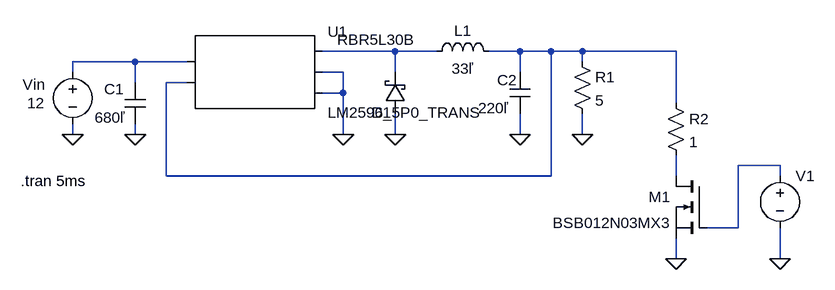
[diagram p0: schematic Voltage_Mode_Control.asc]
Voltage_Mode_Control.asc, the LTspice schematic file:
Version 4
SHEET 1 1144 680
WIRE 496 240 384 240
WIRE 560 240 496 240
WIRE 688 240 640 240
WIRE 736 240 688 240
WIRE 784 240 736 240
WIRE 928 240 784 240
WIRE 96 256 0 256
WIRE 176 256 96 256
WIRE 784 256 784 240
WIRE 0 272 0 256
WIRE 416 272 384 272
WIRE 496 272 496 240
WIRE 688 272 688 240
WIRE 96 288 96 256
WIRE 176 288 144 288
WIRE 416 304 416 272
WIRE 416 304 384 304
WIRE 928 320 928 240
WIRE 0 368 0 352
WIRE 96 368 96 352
WIRE 416 368 416 304
WIRE 496 368 496 336
WIRE 688 368 688 336
WIRE 784 368 784 336
WIRE 1088 416 1024 416
WIRE 144 432 144 288
WIRE 736 432 736 240
WIRE 736 432 144 432
WIRE 928 432 928 400
WIRE 1088 432 1088 416
WIRE 1024 512 1024 416
WIRE 1024 512 976 512
WIRE 928 560 928 528
WIRE 1088 560 1088 512
FLAG 416 368 0
FLAG 0 368 0
FLAG 96 368 0
FLAG 496 368 0
FLAG 688 368 0
FLAG 784 368 0
FLAG 928 560 0
FLAG 1088 560 0
SYMBOL voltage 0 256 R0
WINDOW 0 -77 35 Left 2
WINDOW 3 -70 64 Left 2
WINDOW 123 0 0 Left 0
WINDOW 39 0 0 Left 0
SYMATTR InstName Vin
SYMATTR Value 12
SYMBOL cap 80 288 R0
WINDOW 0 -32 10 Left 2
WINDOW 3 -46 54 Left 2
SYMATTR InstName C1
SYMATTR Value 680ľ
SYMBOL schottky 512 336 R180
WINDOW 0 21 2 Left 2
WINDOW 3 -15 114 Left 2
SYMATTR InstName D1
SYMATTR Value RBR5L30B
SYMATTR Description Diode
SYMATTR Type diode
SYMBOL ind 544 256 R270
WINDOW 0 32 56 VTop 2
WINDOW 3 5 56 VBottom 2
SYMATTR InstName L1
SYMATTR Value 33ľ
SYMBOL cap 672 272 R0
WINDOW 0 -19 12 Left 2
WINDOW 3 -48 55 Left 2
SYMATTR InstName C2
SYMATTR Value 220ľ
SYMBOL AutoGenerated\\LM2596_5P0_TRANS 272 272 R0
SYMATTR InstName U1
SYMBOL res 768 240 R0
SYMATTR InstName R1
SYMATTR Value 5
SYMBOL voltage 1088 416 R0
WINDOW 123 0 0 Left 2
WINDOW 39 0 0 Left 2
WINDOW 3 24 96 Invisible 2
SYMATTR Value PWL(0 0 +2.5m 0 +1u 5)
SYMATTR InstName V1
SYMBOL nmos 976 432 M0
SYMATTR InstName M1
SYMATTR Value BSB012N03MX3
SYMBOL res 912 304 R0
SYMATTR InstName R2
SYMATTR Value 1
TEXT -80 440 Left 2 !.tran 5ms

The netlist it stands for:
* Voltage_Mode_Control.asc
Vin N003 0 12
C1 N003 0 680ľ
D1 0 N001 RBR5L30B
L1 N001 N002 33ľ
C2 N002 0 220ľ
* U1: LM2596_5P0_TRANS (symbol AutoGenerated\LM2596_5P0_TRANS not available, pins judged from their places): pin1=N003 pin2=N002 pin3=N001 pin4=0 pin5=0
R1 N002 0 5
V1 N004 0 PWL(0 0 +2.5m 0 +1u 5)
M1 N005 N004 0 0 BSB012N03MX3
R2 N002 N005 1
.model D D
.lib standard.dio
.model NMOS NMOS
.model PMOS PMOS
.lib standard.mos
.tran 5ms
.backanno
.end